# EAGLE design JST_charging (EAGLE 7.7.0)
AUTHOR: Mary West; DATE: 3/15/2019; VERSION: v01
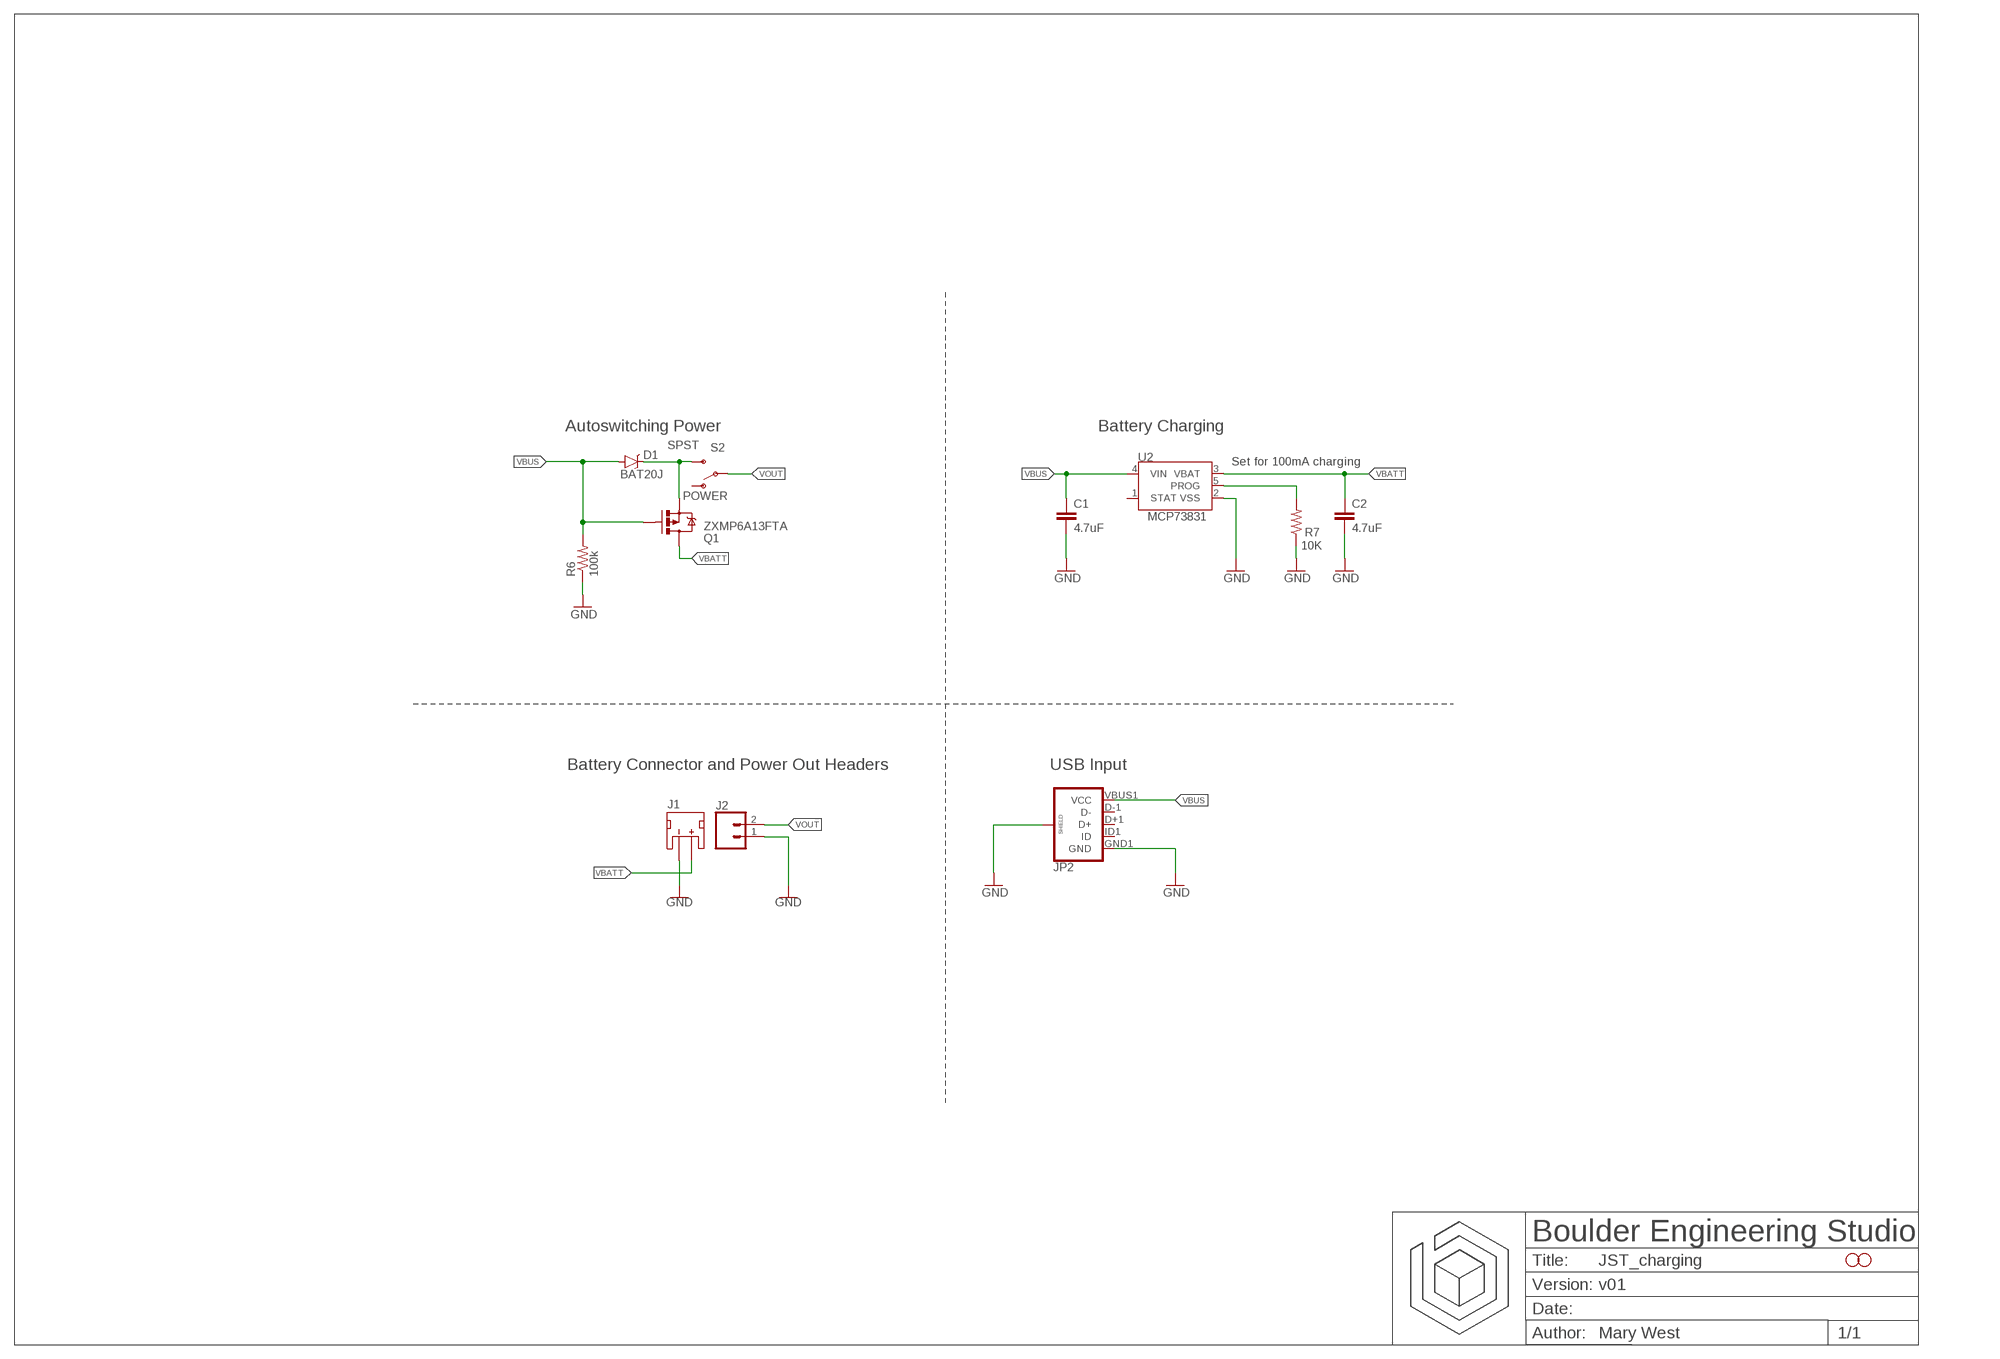
[diagram p0: schematic, sheet 1]

## Parts
C1  4.7uF  CAP0603-CAP  [0603-CAP]
C2  4.7uF  CAP0603-CAP  [0603-CAP]
D1  BAT20J  DIODE-SCHOTTKY-BAT20J  [SOD-323]
H1  STAND-OFFTIGHT  [STAND-OFF-TIGHT]
H2  STAND-OFFTIGHT  [STAND-OFF-TIGHT]
J1  JST_2MM_MALE  [JST-2-SMD]
J2  CONN_021X02_NO_SILK  [1X02_NO_SILK]
JP2  USB_MICROB_PLUGCONN-11752  [USB-B-MICRO-SMD_V03]
Q1  ZXMP6A13FTA  MOSFET-PCHANNEL  [SOT23-3]
R6  100k  100KOHM-1/10W-1%(0603)  [0603-RES]
R7  10K  10KOHM-1/10W-1%(0603)0603  [0603-RES]
S2  POWER  SWITCH-SPDT-SMD-A  [SWITCH-SPST-SMD-A]
U2  MCP73831  [SOT23-5]

## Nets
GND: C1.2 C2.2 J1.1(-) J2.1 JP2.GND1(GND) JP2.SHIELD1(SHIELD) JP2.SHIELD2(SHIELD) JP2.SHIELD3(SHIELD) R6.1 R7.1 U2.2(VSS)
INMOSFET: D1.C Q1.2(S) S2.3(S)
PROG [PRGM]: R7.2 U2.5(PROG)
VBATT [VBATT]: C2.1 J1.2(+) Q1.3(D) U2.3(VBAT)
VBUS [VBUS]: C1.1 D1.A JP2.VBUS1(VCC) Q1.1(G) R6.2 U2.4(VIN)
VOUT [VOUT]: J2.2 S2.2(P)
Unconnected: J1.NC1(PAD1) J1.NC2(PAD2) JP2.D+1(D+) JP2.D-1(D-) JP2.ID1(ID) S2.1(O) U2.1(STAT)

## Notes on the sheet
- Autoswitching Power | Battery Charging
- SPST
- Set for 100mA charging
- Battery Connector and Power Out Headers | USB Input

## Library data of the parts
C1 C2 = SparkFun-Passives:CAP: Capacitor Standard 0603 ceramic capacitor, and 0.1" leaded capacitor.; PROD_ID: CAP-08280
D1 = SparkFun-DiscreteSemi:DIODE-SCHOTTKY: Schottky diodes in SFE's production catalog BAT20J 1A 23V 0.62Vf RB751 120mA 40V 0.37Vf PMEG4005EJ 0.5A 40V 0.42Vf MBRA140 1A 40V 0.5Vf B340A 3A 40V SMA; PROD_ID: DIO-11623
H1 H2 = SparkFun-Hardware:STAND-OFF: Stand Off Drill holes for mechanically mounting via screws, standoffs, etc. Note: Use the keepout ring to avoid running the screw head into surrounding components. Variant Overviews STAND-OFF - Mechanical footprint for a #4 phillips button head screw. STAND-OFF-TIGHT - Mechanical footprint for a #4 phillips button head screw, Example SparkFun Products Screw - Phillips Head (1/4", 4-40, 10 pack) <https://www.sparkfun.com/products/10453> (PRT-10453) Screw - Phillips Head (1/2", 4-40, 10 pack) <https://www.sparkfun.com/products/10452> (PRT-10452) Screw - Phillips Head (3/4", 4-40, 10 pack) <https://www.sparkfun.com/products/10451> (PRT-10451) Screw - Phillips Head (1", 4-40, 10 pack) <https://www.sparkfun.com/products/10450> (PRT-10450)
J1 = SparkFun-Connectors:JST_2MM_MALE: JST 2MM MALE RA CONNECTOR Two pin, compact surface mount connector. Commonly used as a battery input connection point. We really like the solid locking feeling and high current rating on these small connectors. We use these all the time as battery connectors. Mates to single-cell LiPo batteries. Here is the connector we sell at SparkFun: JST Right Angle Connector - White <https://www.sparkfun.com/products/8612> (PRT-08612) Datasheet <http://www.sparkfun.com/datasheets/Prototyping/Connectors/JST-Horizontal.pdf> It was used on these SparkFun products: SparkFun MOSFET Power Controller <https://www.sparkfun.com/products/11214> (PRT-11214) SparkFun Battery Babysitter - LiPo Battery Manager <https://www.sparkfun.com/products/13777> (PRT-13777) And many, many others that required a lipo battery connection.; PROD_ID: CONN-11443; SF_ID: PRT-08612
J2 = SparkFun-Connectors:CONN_02: Multi connection point. Often used as Generic Header-pin footprint for 0.1 inch spaced/style header connections On any of the 0.1 inch spaced packages, you can populate with these: Break Away Headers - Straight <https://www.sparkfun.com/products/116> (PRT-00116) Break Away Male Headers - Right Angle <https://www.sparkfun.com/products/553> (PRT-00553) Female Headers <https://www.sparkfun.com/products/115> (PRT-00115) Break Away Headers - Machine Pin <https://www.sparkfun.com/products/117> (PRT-00117) Break Away Female Headers - Swiss Machine Pin <https://www.sparkfun.com/products/743> (PRT-00743) For SCREWTERMINALS and SPRING TERMINALS visit here: Screw Terimnals on SparkFun.com <https://www.sparkfun.com/search/results?term=Screw+Terminals> (5mm/3.5mm/2.54mm spacing) This device is also useful as a general connection point to wire up your design to another part of your project. Our various solder wires solder well into these plated through hole pads. Hook-Up Wire - Assortment (Stranded, 22 AWG) <https://www.sparkfun.com/products/11375> (PRT-11375) Hook-Up Wire - Assortment (Solid Core, 22 AWG) <https://www.sparkfun.com/products/11367> (PRT-11367) View the entire wire category on our website here <https://www.sparkfun.com/categories/141> Special notes: Molex polarized connector foot print use with: PRT-08233 with associated crimp pins and housings. 2.54_SCREWTERM for use with PRT-10571. 3.5mm Screw Terminal footprints for PRT-08084 5mm Screw Terminal footprints for use with PRT-08432
JP2 = SparkFun-Connectors:USB_MICROB_PLUG: USB Micro-B connectors Some male, some female. Watch your step!; PROD_ID: CONN-11752
Q1 = SparkFun-DiscreteSemi:MOSFET-PCHANNEL: Generic PMOSFET IRLML2244 - TRANS-11153 (SOT-23 -20V -4.3A) (1.Gate 2.Source 3.Drain) FQP27P06 - COM-10349 <http://www.sparkfun.com/products/10349> (TO-220 -60V -27A) (1.Gate 2.Source 3.Drain); PROD_ID: TRANS-08285
R6 = SparkFun-Resistors:100KOHM-1/10W-1%(0603): RES-07828; PROD_ID: RES-07828
R7 = SparkFun-Resistors:10KOHM-1/10W-1%(0603): RES-00824; PROD_ID: RES-00824
S2 = SparkFun-Electromechanical:SWITCH-SPDT: SPDT Switch Simple slide switch, Spark Fun Electronics SKU : COM-00102 DPDT SMT slide switch, AYZ0202, SWCH-08179; PROD_ID: SWCH-10651
U2 = SparkFun:MCP73831: Microchip's MCP73831 Miniature single cell, fully integrated Li-Ion, Li-polymer charge management controller http://ww1.microchip.com/downloads/en/DeviceDoc/21984a.pdf; PROD_ID: IC-09995

## Net classes
1 VBATT: width 0.889 mm
2 VBUS: width 0.889 mm
3 PRGM: width 0.254 mm
4 VOUT: width 1.143 mm
5 INMOSFET: width 1.143 mm

## Board
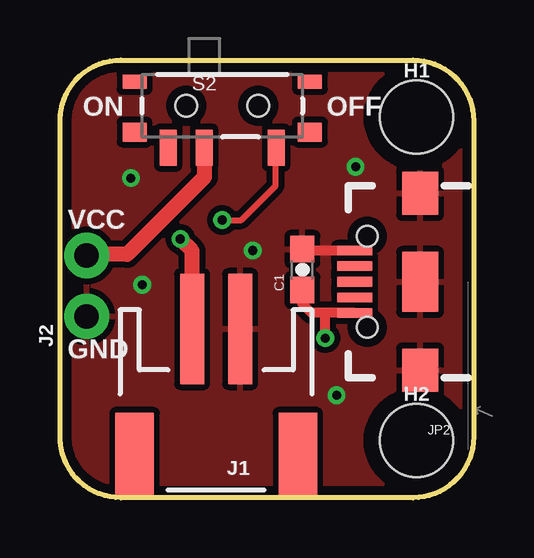
[diagram p1: board, top side]
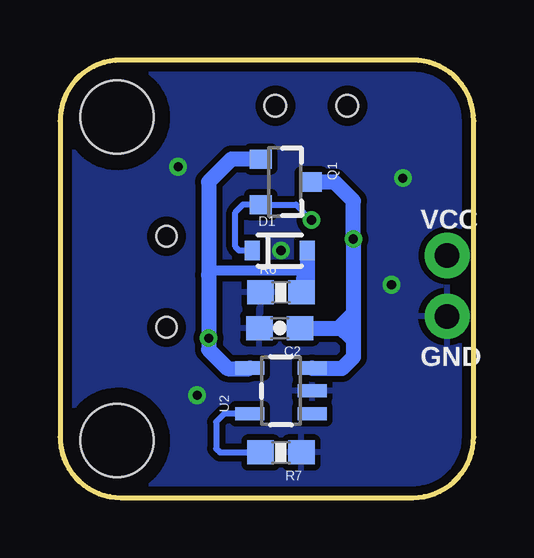
[diagram p2: board, bottom side, seen from below]

Size 17.24 x 18.24 mm. Coordinates in mm from the lower left corner, seen from the top.
Outline: 0,2.54 0,15.7 arc-90 2.54,18.24 14.7,18.24 arc-90 17.24,15.7 17.24,2.54 arc-90 14.7,0 2.54,0 arc-90 0,2.54
Copper layers (1*16): Top 0.0356mm / dielectric 1.5011mm / Bottom 0.0356mm
Design rules "oshpark-2layer": minimum track width 6mil, minimum drill 13mil, track to track 6mil, track to pad 6mil, pad to pad 6mil, via to via 6mil, smd to smd 6mil, copper to edge 15mil, drill to drill 6mil, minimum pad ring 7mil, minimum via ring 7mil, stop-mask expansion 2.5mil, vias tented up to drill 0mil, thermal gap 10mil

### Footprints (pad centres in the part's own frame; a part is rotated, then mirrored left to right if it is on the bottom)
0603-CAP = smd 1.1 x 1: 1 -0.85,0; 2 0.85,0
SOD-323 = smd 0.63 x 0.83: A 1.15,0; C -1.15,0
STAND-OFF-TIGHT = hole 3.048: 0,0
JST-2-SMD = smd 1 x 4.6: 1 -1,-3.7; 2 1,-3.7 | smd 1.6 x 3.4: NC1 -3.4,1.5; NC2 3.4,1.5
1X02_NO_SILK = drill 1.016 pad 1.88: 1 0,0; 2 2.54,0
USB-B-MICRO-SMD_V03 = smd 1.45 x 0.4: D+1 2.725,0; D-1 2.725,0.65; GND1 2.725,-1.3; ID1 2.725,-0.65; VBUS1 2.725,1.3 | smd 1.5 x 1.8: SHIELD1 0,3.685; SHIELD2 0,-3.685 | smd 1.5 x 2.5: SHIELD3 0,0 | hole 0.85: 2.2,1.9; 2.2,-1.9
SOT23-3 = smd 0.8 x 0.9: 1 -0.95,-1; 2 0.95,-1; 3 0,1.1
0603-RES = smd 1.1 x 1: 1 -0.85,0; 2 0.85,0
SWITCH-SPST-SMD-A = smd 0.7 x 1.5: 1 -2.25,-1.75; 2 -0.75,-1.75; 3 2.25,-1.75 | smd 1 x 0.6: GND1 -3.65,1; GND3 3.65,1 | smd 1 x 0.8: GND2 -3.65,-1.1; GND4 3.65,-1.1 | hole 0.9: -1.5,0; 1.5,0
SOT23-5 = smd 0.55 x 1.2: 1 -0.95,-1.3; 2 0,-1.3; 3 0.95,-1.3; 4 0.95,1.3; 5 -0.95,1.3

### Placement (x,y rotation side)
C1  10.1,9.51 90 top
C2  8.08,7.07 180 bottom
D1  8.08,10.3 0 bottom
H1  14.86,15.86 0 top
H2  14.86,2.38 0 top
J1  6.51,3.33 180 top
J2  1.11,7.56 90 top
JP2  15,9 180 top
Q1  7.87,13.16 270 bottom
R6  8.03,8.56 0 bottom
R7  8.03,1.89 180 bottom
S2  6.76,16.34 0 top
U2  8.03,4.45 90 bottom

### Tracks (layer width: path | path; a pad name or v marks a point on that pad's centre or on a via)
GND  (via drill 0.38)
  Top 0.406: JP2.GND1 10.16,10.3 C1.2
  other vias: 2.95,13.32 3.43,8.87 11.53,4.27 12.32,13.79 8.03,10.3
  pour Bottom (isolate 0.25): 0,18 17,18 17,0 0,0
  pour Top (isolate 0.25): 0,18 17,18 17,0 0,0
INMOSFET  (via drill 0.38)
  Top 0.254: v6.76,11.57 7.56,11.57 8.98,13 8.98,14.56 S2.3
  Bottom 0.254: D1.C 9.78,10.3 9.94,10.46 9.94,11.89 9.62,12.21 Q1.2 7.4,12.21 v6.76,11.57
PROG
  Bottom 0.254: U2.5 10.39,3.5 10.73,3.16 10.73,2.05 10.57,1.89 R7.2
VBATT  (via drill 0.38)
  Top 0.635: J1.2 5.51,10.29 v5.02,10.78
  Bottom 0.635: Q1.3 5.81,13.16 5.02,12.37 v5.02,10.78 5.02,7.67 | 5.02,7.67 5.02,5.86 5.49,5.38 6.71,5.38 U2.3 | C2.1 5.62,7.07 | 5.62,7.07 5.02,7.67 | 5.62,7.07 5.51,7.07 5.15,6.71 5.15,6.73 5.12,6.76
VBUS  (via drill 0.38)
  Top 0.406: JP2.VBUS1 11.05,7.7 | 11.05,7.7 10.48,7.7 10.1,8.08 C1.1 | v11.05,6.65 11.05,7.7
  Bottom 0.406: R6.2 7.18,9.2 6.93,9.45 10.87,9.45 11.05,9.27
  Bottom 0.635: Q1.1 10.1,14.11 11.05,13.16 11.05,9.27 v11.05,6.65 11.05,6.17 10.26,5.38 9.36,5.38 U2.4 | D1.A 6.93,8.8 R6.2
VOUT
  Top 0.635: S2.2 6.01,13.36 2.79,10.14 1.16,10.14 J2.2

### Text on the board
tPlace: ON | OFF | VCC | GND
bPlace: VCC | GND